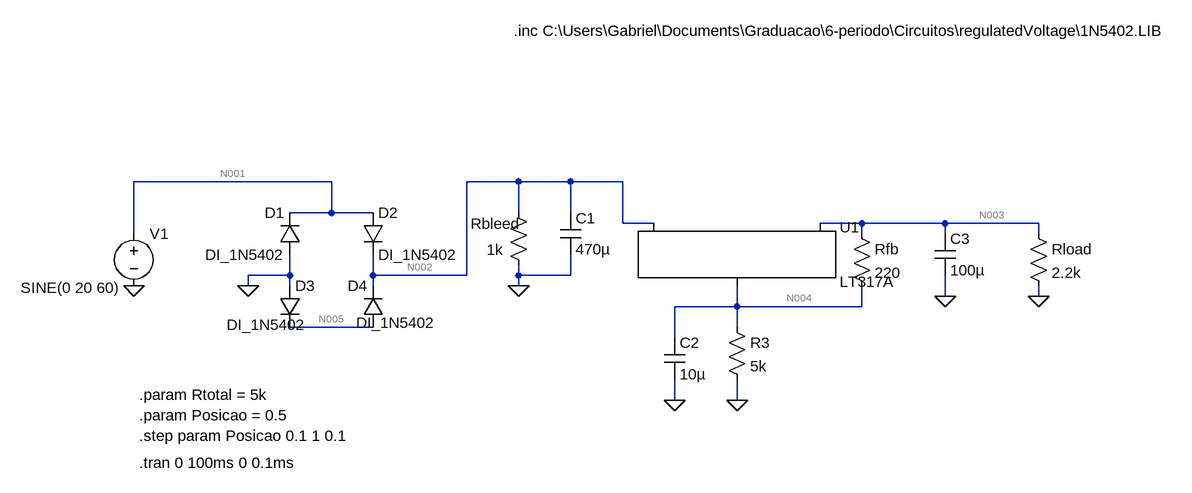
[diagram p0: schematic Draft1.asc]
Draft1.asc, the LTspice schematic file:
Version 4.1
SHEET 1 1928 680
WIRE 512 -80 208 -80
WIRE 800 -80 720 -80
WIRE 880 -80 800 -80
WIRE 960 -80 880 -80
WIRE 512 -32 512 -80
WIRE 512 -32 448 -32
WIRE 576 -32 512 -32
WIRE 800 -32 800 -80
WIRE 880 -32 880 -80
WIRE 960 -16 960 -80
WIRE 1008 -16 960 -16
WIRE 1328 -16 1264 -16
WIRE 1456 -16 1328 -16
WIRE 1600 -16 1456 -16
WIRE 208 0 208 -80
WIRE 1328 0 1328 -16
WIRE 1456 0 1456 -16
WIRE 1600 0 1600 -16
WIRE 448 64 448 32
WIRE 448 64 384 64
WIRE 576 64 576 32
WIRE 720 64 720 -80
WIRE 720 64 576 64
WIRE 800 64 800 48
WIRE 880 64 880 32
WIRE 880 64 800 64
WIRE 384 80 384 64
WIRE 448 80 448 64
WIRE 576 80 576 64
WIRE 800 80 800 64
WIRE 1456 96 1456 64
WIRE 1600 96 1600 80
WIRE 1136 112 1136 80
WIRE 1136 112 1040 112
WIRE 1328 112 1328 80
WIRE 1328 112 1136 112
WIRE 576 144 448 144
WIRE 1136 144 1136 112
WIRE 1040 160 1040 112
WIRE 1040 256 1040 224
WIRE 1136 256 1136 224
FLAG 384 80 0
FLAG 800 80 0
FLAG 1136 256 0
FLAG 1040 256 0
FLAG 1456 96 0
FLAG 1600 96 0
FLAG 208 80 0
SYMBOL voltage 208 -16 R0
WINDOW 3 -174 99 Left 2
WINDOW 123 -174 127 Left 2
WINDOW 39 0 0 Left 0
SYMATTR InstName V1
SYMATTR Value SINE(0 20 60)
SYMBOL diode 464 32 R180
WINDOW 0 24 64 Left 2
WINDOW 3 24 0 Left 2
SYMATTR InstName D1
SYMATTR Value DI_1N5402
SYMBOL diode 560 -32 R0
SYMATTR InstName D2
SYMATTR Value DI_1N5402
SYMBOL diode 432 80 R0
WINDOW 3 -81 60 Left 2
SYMATTR InstName D3
SYMATTR Value DI_1N5402
SYMBOL diode 592 144 R180
WINDOW 0 24 64 Left 2
WINDOW 3 -80 7 Left 2
SYMATTR InstName D4
SYMATTR Value DI_1N5402
SYMBOL res 784 -48 R0
WINDOW 0 -58 33 Left 2
WINDOW 3 -33 73 Left 2
SYMATTR InstName Rbleed
SYMATTR Value 1k
SYMATTR SpiceLine pwr=1
SYMBOL PowerProducts\\LT317A 1136 -16 R0
SYMATTR InstName U1
SYMBOL res 1312 -16 R0
SYMATTR InstName Rfb
SYMATTR Value 220
SYMATTR SpiceLine pwr=1
SYMBOL res 1120 128 R0
SYMATTR InstName R3
SYMATTR Value 5k
SYMBOL cap 1024 160 R0
SYMATTR InstName C2
SYMATTR Value 10µ
SYMATTR SpiceLine V=50 Irms=0 Rser=0.003 Lser=1.2n mfg="Würth Elektronik" pn="885012214005 WCAP-CSGP 2220" type="X7R"
SYMBOL cap 1440 0 R0
WINDOW 3 24 56 Left 2
SYMATTR InstName C3
SYMATTR Value 100µ
SYMATTR Description Capacitor
SYMATTR Type cap
SYMATTR SpiceLine V=35 Irms=231m Rser=0.38 Lser=2.98n mfg="Würth Elektronik" pn="860010573007 WCAP-ATG8 6,3x11" type="Al electrolytic"
SYMBOL res 1584 -16 R0
SYMATTR InstName Rload
SYMATTR Value 2.2k
SYMBOL cap 864 -32 R0
SYMATTR InstName C1
SYMATTR Value 470µ
TEXT 792 -312 Left 2 !.inc C:\\Users\\Gabriel\\Documents\\Graduacao\\6-periodo\\Circuitos\\regulatedVoltage\\1N5402.LIB
TEXT 216 248 Left 2 !.param Rtotal = 5k\n.param Posicao = 0.5\n.step param Posicao 0.1 1 0.1
TEXT 216 352 Left 2 !.tran 0 100ms 0 0.1ms

The netlist it stands for:
* Draft1.asc
V1 N001 0 SINE(0 20 60)
D1 0 N001 DI_1N5402
D2 N001 N002 DI_1N5402
D3 0 N005 DI_1N5402
D4 N005 N002 DI_1N5402
Rbleed N002 0 1k pwr=1
X§U1 N004 N003 N002 LT317A
Rfb N003 N004 220 pwr=1
R3 N004 0 5k
C2 N004 0 10µ V=50 Irms=0 Rser=0.003 Lser=1.2n mfg="Würth Elektronik" pn="885012214005 WCAP-CSGP 2220" type="X7R"
C3 N003 0 100µ V=35 Irms=231m Rser=0.38 Lser=2.98n mfg="Würth Elektronik" pn="860010573007 WCAP-ATG8 6,3x11" type="Al electrolytic"
Rload N003 0 2.2k
C1 N002 0 470µ
.model D D
.lib standard.dio
.inc C:\Users\Gabriel\Documents\Graduacao\6-periodo\Circuitos\regulatedVoltage\1N5402.LIB
.param Rtotal = 5k
.param Posicao = 0.5
.step param Posicao 0.1 1 0.1
.tran 0 100ms 0 0.1ms
.lib LTC.lib
.backanno
.end

* Results of the author's LTspice run, read from the files saved beside the schematic
* Operating Point (first step), zero values left out:
*   V(n002) = 2.927 µV
*   V(n004) = -4.348 µV
*   V(n003) = -4.54 µV
*   V(n005) = 1.463 µV
*   I(V1) = 4.194 pA
*   I(D4) = -2.097 pA
*   I(Rload) = -2.064 nA
*   I(D2) = -4.194 pA
*   I(Rbleed) = 2.927 nA
*   I(D3) = -2.097 pA
*   I(Rfb) = -869.7 pA
*   I(R3) = -869.7 pA
*   Ix(u1:2) = 2.933 nA
*   Ix(u1:3) = -2.933 nA
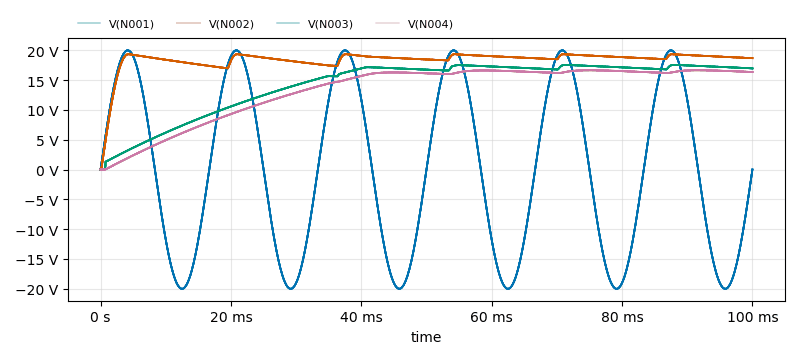
[diagram p1: Transient Analysis of Draft1.asc, plotted from the saved traces]
* Transient Analysis, 10 runs:
*   V(N001) [posicao=0.1]: min -20 V, max 20 V, average 257.5 µV, rms 14.14 V, last 0 V
*   V(N001) [posicao=0.2]: min -20 V, max 20 V, average 257.5 µV, rms 14.14 V, last 0 V
*   V(N001) [posicao=0.3]: min -20 V, max 20 V, average 257.5 µV, rms 14.14 V, last 0 V
*   V(N001) [posicao=0.4]: min -20 V, max 20 V, average 257.5 µV, rms 14.14 V, last 0 V
*   V(N001) [posicao=0.5]: min -20 V, max 20 V, average 257.5 µV, rms 14.14 V, last 0 V
*   V(N001) [posicao=0.6]: min -20 V, max 20 V, average 257.5 µV, rms 14.14 V, last 0 V
*   V(N001) [posicao=0.7]: min -20 V, max 20 V, average 257.5 µV, rms 14.14 V, last 0 V
*   V(N001) [posicao=0.8]: min -20 V, max 20 V, average 257.5 µV, rms 14.14 V, last 0 V
*   V(N002) [posicao=0.1]: min 2.927 µV, max 19.36 V, average 18.39 V, rms 18.49 V, last 18.69 V
*   V(N002) [posicao=0.2]: min 2.927 µV, max 19.36 V, average 18.39 V, rms 18.49 V, last 18.69 V
*   V(N002) [posicao=0.3]: min 2.927 µV, max 19.36 V, average 18.39 V, rms 18.49 V, last 18.69 V
*   V(N002) [posicao=0.4]: min 2.927 µV, max 19.36 V, average 18.39 V, rms 18.49 V, last 18.69 V
*   V(N002) [posicao=0.5]: min 2.927 µV, max 19.36 V, average 18.39 V, rms 18.49 V, last 18.69 V
*   V(N002) [posicao=0.6]: min 2.927 µV, max 19.36 V, average 18.39 V, rms 18.49 V, last 18.69 V
*   V(N002) [posicao=0.7]: min 2.927 µV, max 19.36 V, average 18.39 V, rms 18.49 V, last 18.69 V
*   V(N002) [posicao=0.8]: min 2.927 µV, max 19.36 V, average 18.39 V, rms 18.49 V, last 18.69 V
*   V(N003) [posicao=0.1]: min -4.54 µV, max 17.55 V, average 14.3 V, rms 15.01 V, last 16.98 V
*   V(N003) [posicao=0.2]: min -4.54 µV, max 17.55 V, average 14.3 V, rms 15.01 V, last 16.98 V
*   V(N003) [posicao=0.3]: min -4.54 µV, max 17.55 V, average 14.3 V, rms 15.01 V, last 16.98 V
*   V(N003) [posicao=0.4]: min -4.54 µV, max 17.55 V, average 14.3 V, rms 15.01 V, last 16.98 V
*   V(N003) [posicao=0.5]: min -4.54 µV, max 17.55 V, average 14.3 V, rms 15.01 V, last 16.98 V
*   V(N003) [posicao=0.6]: min -4.54 µV, max 17.55 V, average 14.3 V, rms 15.01 V, last 16.98 V
*   V(N003) [posicao=0.7]: min -4.54 µV, max 17.55 V, average 14.3 V, rms 15.01 V, last 16.98 V
*   V(N003) [posicao=0.8]: min -4.54 µV, max 17.55 V, average 14.3 V, rms 15.01 V, last 16.98 V
*   V(N004) [posicao=0.1]: min -4.348 µV, max 16.67 V, average 13.35 V, rms 14.18 V, last 16.37 V
*   V(N004) [posicao=0.2]: min -4.348 µV, max 16.67 V, average 13.35 V, rms 14.18 V, last 16.37 V
*   V(N004) [posicao=0.3]: min -4.348 µV, max 16.67 V, average 13.35 V, rms 14.18 V, last 16.37 V
*   V(N004) [posicao=0.4]: min -4.348 µV, max 16.67 V, average 13.35 V, rms 14.18 V, last 16.37 V
*   V(N004) [posicao=0.5]: min -4.348 µV, max 16.67 V, average 13.35 V, rms 14.18 V, last 16.37 V
*   V(N004) [posicao=0.6]: min -4.348 µV, max 16.67 V, average 13.35 V, rms 14.18 V, last 16.37 V
*   V(N004) [posicao=0.7]: min -4.348 µV, max 16.67 V, average 13.35 V, rms 14.18 V, last 16.37 V
*   V(N004) [posicao=0.8]: min -4.348 µV, max 16.67 V, average 13.35 V, rms 14.18 V, last 16.37 V